# Altium schematic sheet lab1.SchDoc
size 420 x 297 mm; SheetNumber: 1; SheetTotal: 1
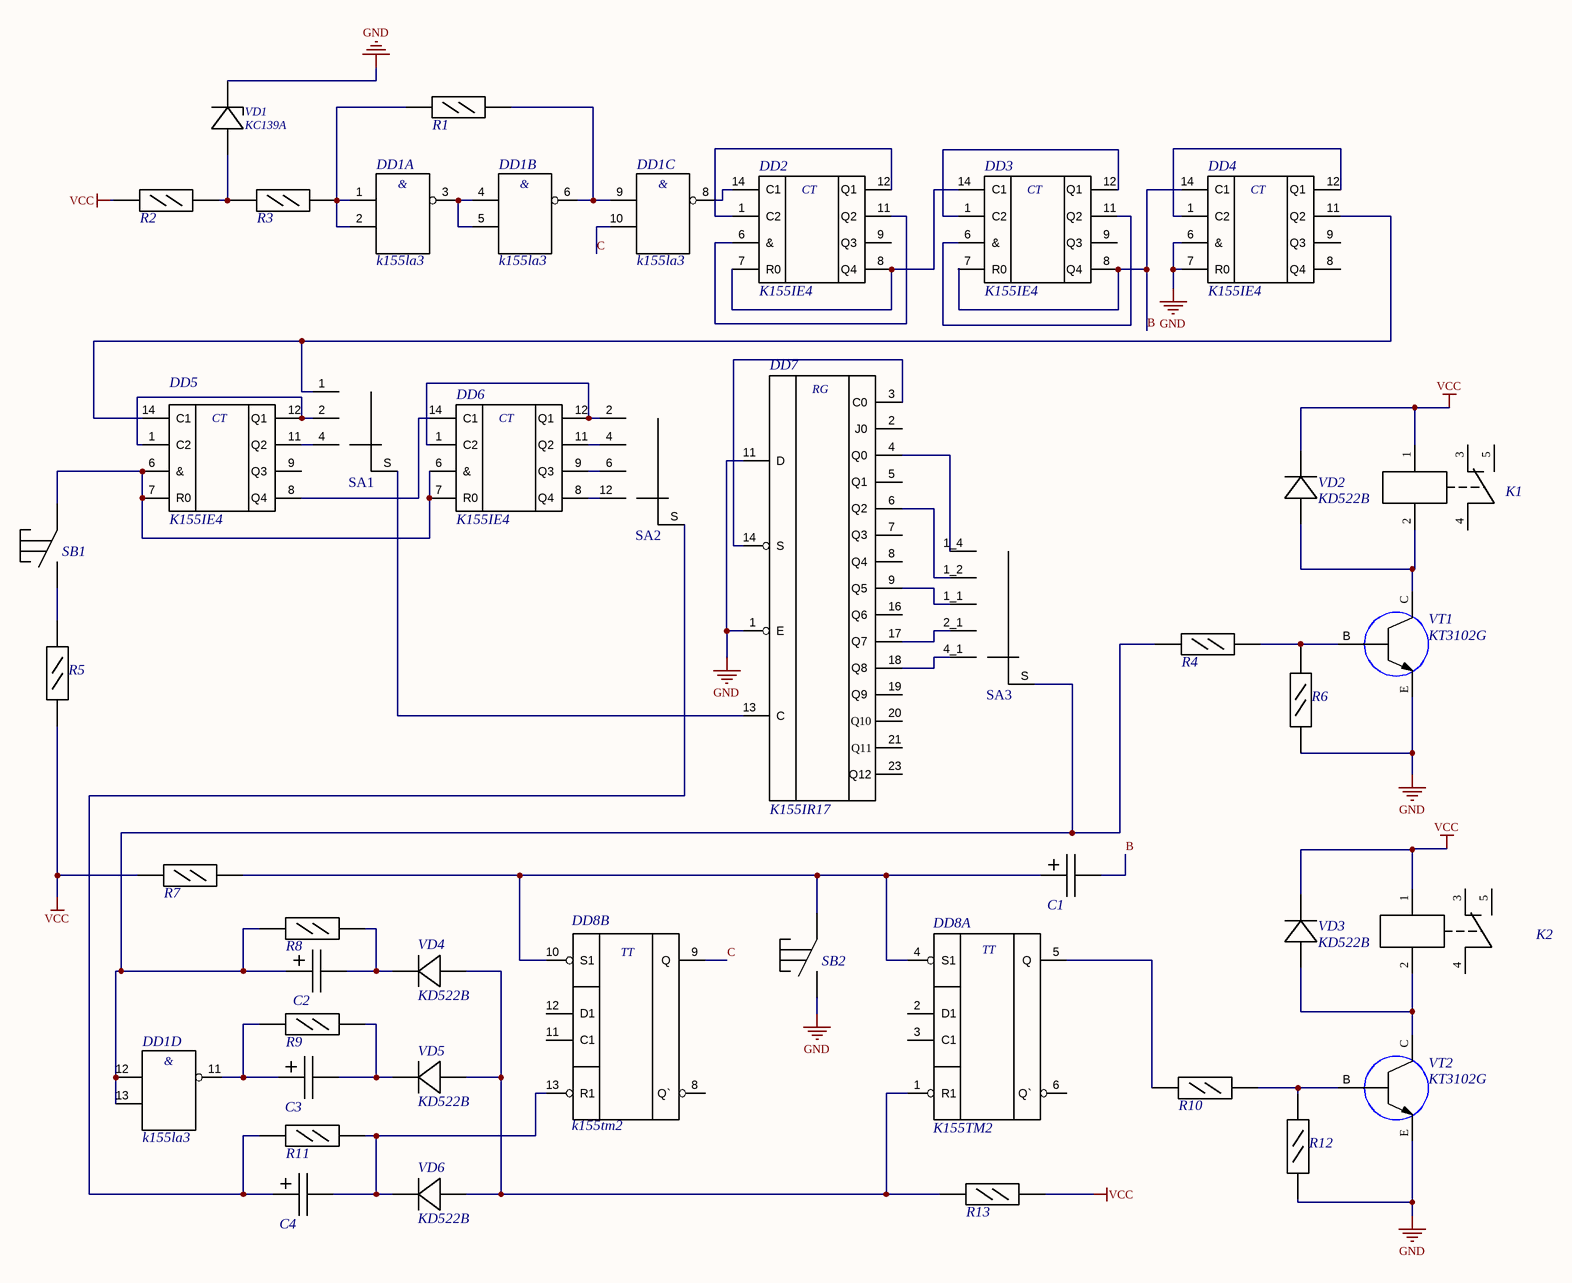
[diagram p0: lab1.SchDoc]

## Parts
C1  Condensator  [SM127P600-8N]  (value not drawn)
C2  Condensator  [SM127P600-8N]  (value not drawn)
C3  Condensator  [SM127P600-8N]  (value not drawn)
C4  Condensator  [SM127P600-8N]  (value not drawn)
DD1  k155la3  [k155la3]  (parts A,B,C,D of 4)
DD2  K155IE4  [k155ie4]
DD3  K155IE4  [k155ie4]
DD4  K155IE4  [k155ie4]
DD5  K155IE4  [k155ie4]
DD6  K155IE4  [k155ie4]
DD7  K155IR17  [k155ir17]
DD8  K155TM2  [k155tm2]  (parts A,B of 2)
K1  Releu  [RELAY_SRD-05VDC-SL-C]  (value not drawn)
K2  Releu  [RELAY_SRD-05VDC-SL-C]  (value not drawn)
R1  Resistor  [RESC3517X06N]  (value not drawn)
R2  Resistor  [RESC3517X06N]  (value not drawn)
R3  Resistor  [RESC3517X06N]  (value not drawn)
R4  Resistor  [RESC3517X06N]  (value not drawn)
R5  Resistor  [RESC3517X06N]  (value not drawn)
R6  Resistor  [RESC3517X06N]  (value not drawn)
R7  Resistor  [RESC3517X06N]  (value not drawn)
R8  Resistor  [RESC3517X06N]  (value not drawn)
R9  Resistor  [RESC3517X06N]  (value not drawn)
R10  Resistor  [RESC3517X06N]  (value not drawn)
R11  Resistor  [RESC3517X06N]  (value not drawn)
R12  Resistor  [RESC3517X06N]  (value not drawn)
R13  Resistor  [RESC3517X06N]  (value not drawn)
SA1  3P1N  [SA1]  (value not drawn)
SA2  4P1N  [SA2]  (value not drawn)
SA3  5P1N  [SA3]  (value not drawn)
SB1  Intrerupator  [Buton]  (value not drawn)
SB2  Intrerupator  [Buton]  (value not drawn)
VD1  KC139A  [Zener]
VD2  KD522B  [Dioda]
VD3  KD522B  [Dioda]
VD4  KD522B  [Dioda]
VD5  KD522B  [Dioda]
VD6  KD522B  [Dioda]
VT1  KT3102G  [Transistor NPN]
VT2  KT3102G  [Transistor NPN]

## Nets
GND: DD4.6(&) DD4.7(R0) DD7.1(E) DD7.11(D) R6.1 R12.1 SB2.2 VD1.2 VT1.E VT2.E
VCC: K1.1 K2.1 R2.1 R5.1 R7.1 R13.2 VD2.2 VD3.2
B: C1.1 DD3.8(Q4) DD4.14(C1)
C: DD1.10 DD8.9(Q)
NetC1_2: C1.2 DD8.4(S1) DD8.10(S1) R7.2 SB2.1
NetC2_1: C2.1 R8.2 VD4.2
NetC2_2: C2.2 DD1.12 DD1.13 R4.1 R8.1 SA3.S
NetC3_1: C3.1 R9.2 VD5.2
NetC3_2: C3.2 DD1.11 R9.1
NetC4_1: C4.1 DD8.13(R1) R11.2 VD6.2
NetC4_2: C4.2 R11.1 SA2.S
NetDD1_1: DD1.1 DD1.2 R1.1 R3.2
NetDD1_3: DD1.3 DD1.4 DD1.5
NetDD1_6: DD1.6 DD1.9 R1.2
NetDD1_8: DD1.8 DD2.14(C1)
NetDD2_1: DD2.1(C2) DD2.12(Q1)
NetDD2_6: DD2.6(&) DD2.11(Q2)
NetDD2_7: DD2.7(R0) DD2.8(Q4) DD3.14(C1)
NetDD3_1: DD3.1(C2) DD3.12(Q1)
NetDD3_6: DD3.6(&) DD3.11(Q2)
NetDD4_1: DD4.1(C2) DD4.12(Q1)
NetDD4_11: DD4.11(Q2) DD5.14(C1) SA1.1
NetDD5_1: DD5.1(C2) DD5.12(Q1) SA1.2
NetDD5_6: DD5.6(&) DD5.7(R0) DD6.6(&) DD6.7(R0) SB1.1
NetDD5_8: DD5.8(Q4) DD6.14(C1)
NetDD5_11: DD5.11(Q2) SA1.4
NetDD6_1: DD6.1(C2) DD6.12(Q1) SA2.2
NetDD6_8: DD6.8(Q4) SA2.12
NetDD6_9: DD6.9(Q3) SA2.6
NetDD6_11: DD6.11(Q2) SA2.4
NetDD7_3: DD7.3(C0) DD7.14(S)
NetDD7_4: DD7.4(Q0) SA3.1_4
NetDD7_6: DD7.6(Q2) SA3.1_2
NetDD7_9: DD7.9(Q5) SA3.1_1
NetDD7_13: DD7.13(C) SA1.S
NetDD7_17: DD7.17(Q7) SA3.2_1(2:1)
NetDD7_18: DD7.18(Q8) SA3.4_1
NetDD8_1: DD8.1(R1) R13.1 VD4.1 VD5.1 VD6.1
NetDD8_5: DD8.5(Q) R10.1
NetK1_2: K1.2 VD2.1 VT1.C
NetK2_2: K2.2 VD3.1 VT2.C
NetR2_2: R2.2 R3.1 VD1.1
NetR4_2: R4.2 R6.2 VT1.B
NetR5_2: R5.2 SB1.2
NetR10_2: R10.2 R12.2 VT2.B

Not connected (* = marked no-connect by the designer): DD2 9(Q3); DD3 7(R0) 9(Q3); DD4 8(Q4) 9(Q3); DD5 9(Q3); DD7 2(J0) 5(Q1) 7(Q3) 8(Q4) 16(Q6) 19(Q9) 20(Q10) 21(Q11) 23(Q12); DD8 2(D1) 3(C1) 6(Q`) 8(Q`) 11(C1) 12(D1); K1 3 4 5; K2 3 4 5

## Notes on the sheet
- THIS DOCUMENT AND THE DATA DISCLOSED HEREIN OR
- HEREWITH IS THE PROPERTY OF ALTIUM LIMITED AND MAY
- DWG NO:
- REVISION
- REV:
- DESCRIPTION
- DATE
- APPROVED
- BE FREELY DISTRIBUTED IN WHOLE. NO RIGHTS ARE
- RESERVED OR EXPRESS OR IMPLIED WARANTEE GIVEN.
- ENG:
- APPROVALS
- PROJECT
- DSN:
- CHK:
- REFERENCE DOCUMENTS
- PROJECT REVISION:
- TITLE
- DOCUMENT REVISION:
- DESIGN ITEM:
- BOM:
- FAB DWG:
- PCB DWG:
- ASSY DWG:
- SCALE:
- A3
- SIZE
- CAGE CODE
- FILE NAME
- DWG NO.
- SHEET
- OF
- REV
- (in symbol k155ie4) CT
- (in symbol k155ir17) RG
- (in symbol k155la3, part A) &
- (in symbol k155la3, part B) &
- (in symbol k155la3, part C) &
- (in symbol k155la3, part D) &
- (in symbol k155tm2, part A) TT
- (in symbol k155tm2, part B) TT

## Library data of the parts
SA1 = SA1
SA2 = SA2
SA3 = SA3
VD1 = Zener
VD2-VD6 = Dioda
VT1 VT2 = TransistorNPN